# EAGLE design Connectors-MK2-1ch (EAGLE 9.6.2)
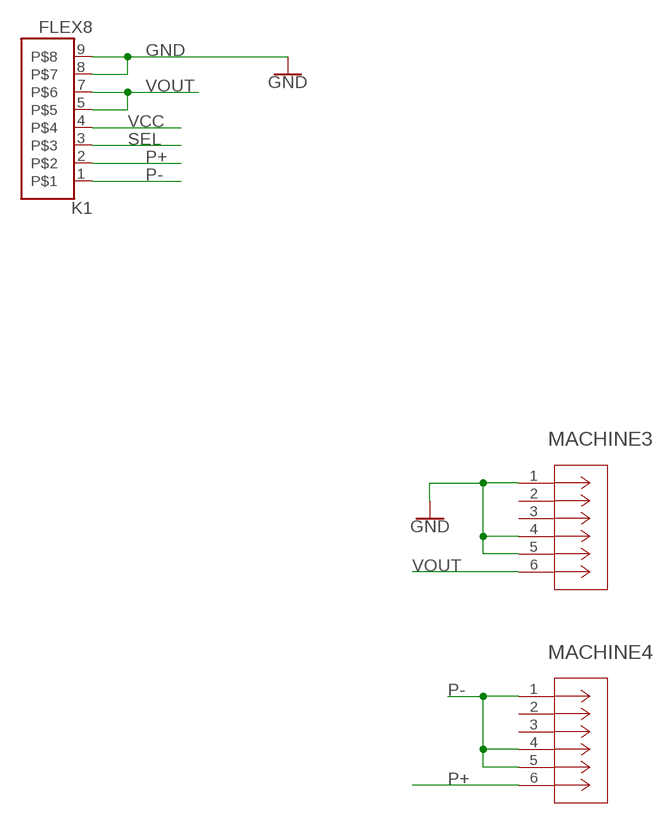
[diagram p0: schematic, sheet 1]

## Parts
K1  FLEX8  [FLEX8]
MACHINE3  ACJS-MHDR  [CONN_MHDR_AMP]
MACHINE4  ACJS-MHDR  [CONN_MHDR_AMP]

## Nets
GND: K1.8 K1.9 MACHINE3.1 MACHINE3.4 MACHINE3.5
P+: K1.2 MACHINE4.6
P-: K1.1 MACHINE4.1 MACHINE4.4 MACHINE4.5
SEL: K1.3
VCC: K1.4
VOUT: K1.5 K1.7 MACHINE3.6
Unconnected: MACHINE3.2 MACHINE3.3 MACHINE4.2 MACHINE4.3

## Library data of the parts
K1 = Flex_3mm:FLEX8: WR-FPC 1mm SMT Horiz. Bot. Contact Hinge type WR-FPC 1mm 08 pins Hinge type SMT Horizontal Bottom Contact ;=>Code : Con_FPC_ZIF_1.00_6861xx148922_686108148922 <http://katalog.we-online.de/media/images/eican/Con_FPC_ZIF_1.00_686110148922_pf2.jpg> Details see: http://katalog.we-online.de/em/datasheet/6861xx148922.pdf Created 2014-10-08, Karrer Zheng 2014 (C) Wurth Elektronik
MACHINE3 MACHINE4 = ACJSMHDR:ACJS-MHDR; BUILT_BY: EMA_Matt; COPYRIGHT: Copyright (C) 2018 Accelerated Designs. All rights reserved; MANUFACTURER_PART_NUMBER: ACJS-MHDR; SOURCELIBRARY: Amphenol_2019-10-30; VENDOR: Amphenol

## Board
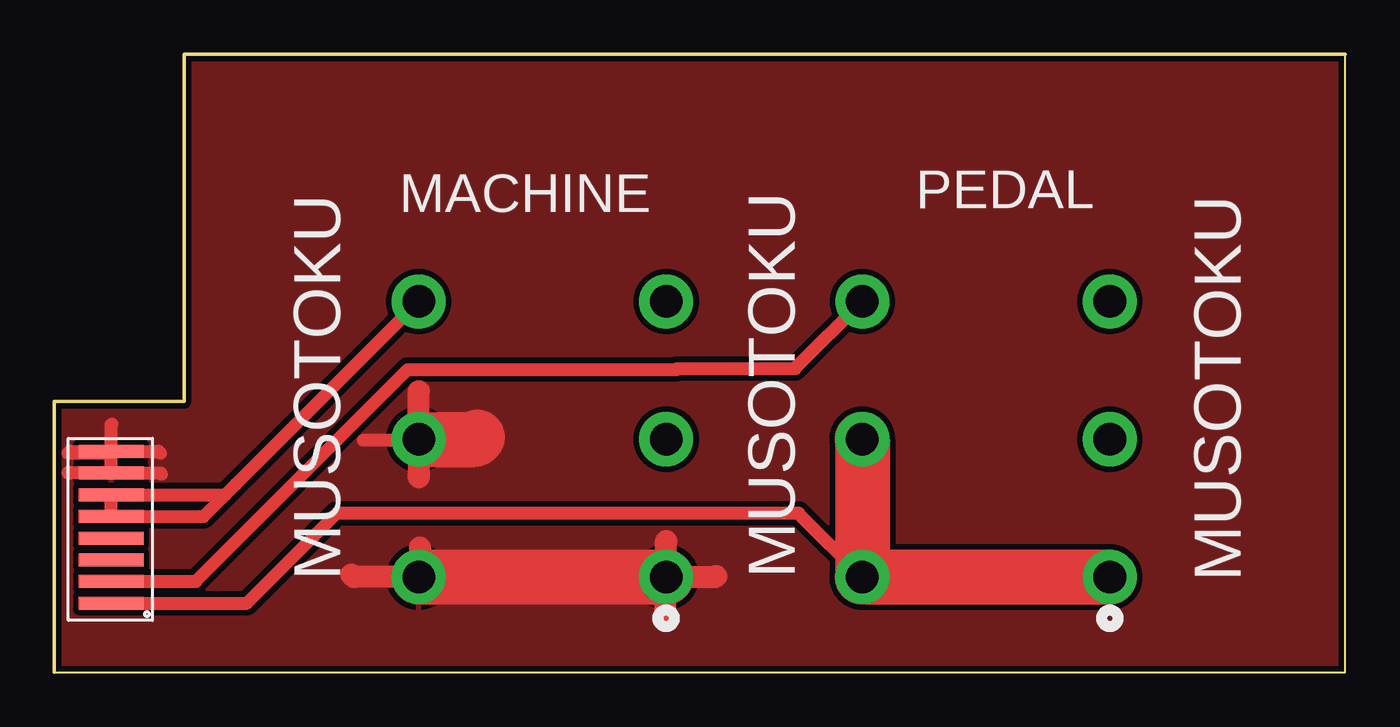
[diagram p1: board, top side]
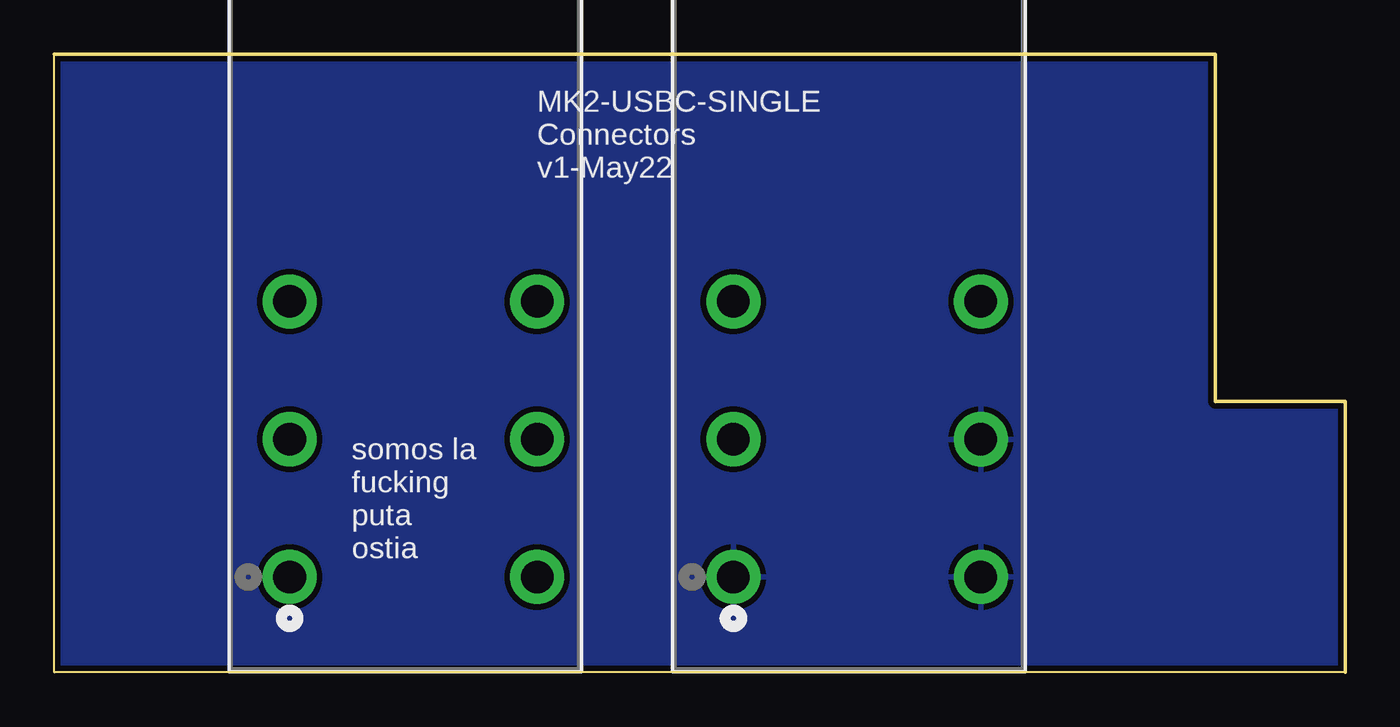
[diagram p2: board, bottom side, seen from below]

Size 59.5 x 28.5 mm. Coordinates in mm from the lower left corner, seen from the top.
Outline: 0,0 59.5,0 59.5,28.5 6,28.5 6,12.5 0,12.5 0,0
Copper layers (1*16): Top 0.035mm / dielectric 1.5mm / Bottom 0.035mm
Design rules "default *": minimum track width 6mil, minimum drill 0.35mm, track to track 6mil, track to pad 6mil, pad to pad 6mil, via to via 6mil, smd to smd 6mil, copper to edge 10mil, drill to drill 6mil, minimum pad ring 10mil, minimum via ring 8mil, stop-mask expansion 4mil, vias tented up to drill 0mil, thermal gap 10mil

### Footprints (pad centres in the part's own frame; a part is rotated, then mirrored left to right if it is on the bottom)
FLEX8 = smd 0.6 x 3: 1 0.8,2.05; 2 1.8,2.05; 3 2.8,2.05; 4 3.8,2.05; 5 4.8,2.05; 7 5.8,2.05; 8 6.8,2.05; 9 7.8,2.05
CONN_MHDR_AMP = drill 1.5 pad 2.5: 1 0,0; 2 -6.35,0; 3 -12.7,0; 4 0,11.405; 5 -6.35,11.405; 6 -12.7,11.405

### Placement (x,y rotation side)
K1  4.67,2.39 90 top
MACHINE3  28.2,4.4 270 bottom
MACHINE4  48.65,4.4 270 bottom

### Tracks (layer width: path | path; a pad name or v marks a point on that pad's centre or on a via)
GND
  Top 0.61: 16.8,12.95 16.65,13.1 | 16.74,10.7 14.25,10.7 | K1.9 2.62,11.42 2.65,11.45 | K1.9 4.81,10.19 4.9,10.1 | K1.8 4.91,9.19 4.95,9.15 | K1.8 0.65,9.19 0.63,9.2 | K1.9 2.53,10.1 0.63,10.1 0.73,10.19 K1.9 | K1.8 K1.9
  Top 1.016: MACHINE3.5 16.9,10.85 18.9,10.85 | MACHINE3.5 16.8,12.95 | 16.8,9 16.8,10.64 16.74,10.7 MACHINE3.5 | MACHINE3.4 16.85,4.4 16.85,5.75 | MACHINE3.4 16.84,4.45 18.7,4.45 | MACHINE3.4 13.8,4.4 13.7,4.5 | MACHINE3.1 30.45,4.4 30.5,4.45 | MACHINE3.1 28.2,6.05 | MACHINE3.1 28.15,4.35 28.15,2.6 | MACHINE3.1 28.1,4.3 25.55,4.3
  Top 2.54: MACHINE3.4 MACHINE3.1 | MACHINE3.5 19.4,10.75 19.5,10.85
  pour Top (isolate 0.254, rank 2): -2.35,-0.3 61.5,-0.3 61.5,32.83 -2.35,32.83
  pour Bottom (isolate 0.254, rank 2): -1.45,-1.15 62.45,-1.15 62.45,31.13 -1.45,31.13
P+
  Top 0.406: 28.66,13.96 28.7,14
  Top 0.61: K1.2 6.52,4.19 16.29,13.96 28.66,13.96 | 28.7,14 34.14,14 MACHINE4.6
P-
  Top 0.61: MACHINE4.4 34.31,7.34 13.02,7.34 8.87,3.19 K1.1
  Top 2.54: MACHINE4.5 MACHINE4.4 MACHINE4.1
VOUT
  Top 0.61: 7.88,8.19 K1.7 K1.5 6.88,7.19 7.88,8.19 | 7.88,8.19 8.37,8.68 MACHINE3.6

### Text on the board
tNames: MACHINE | PEDAL | MUSOTOKU | MUSOTOKU | MUSOTOKU
bNames: MK2-USBC-SINGLE / Connectors / v1-May22 | somos la / fucking / puta / ostia